# EAGLE schematic untitled (EAGLE 8.0.1)
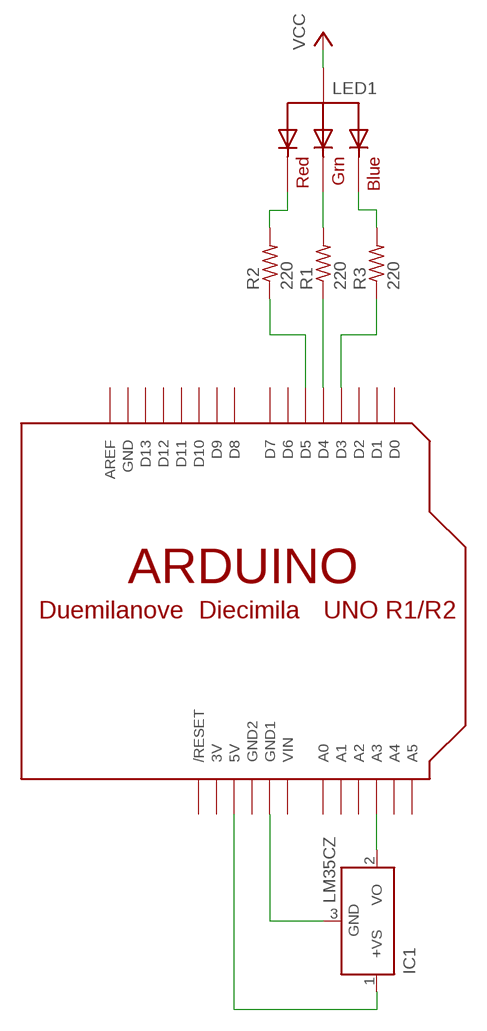
[diagram p0: schematic, sheet 1]

## Parts
IC1  LM35CZ  [TO92]
LED1  RGBLED_CA-5MM  [LED5MMRGB]
R1  220  R-US_0204/5  [0204/5]
R2  220  R-US_0204/5  [0204/5]
R3  220  R-US_0204/5  [0204/5]
U$1  ARDUINOUNO  [ARDUINO]

## Nets
N$1: IC1.3(GND) U$1.GND1
N$2: IC1.1(+VS) U$1.5V
N$3: IC1.2(VO) U$1.A3
N$4: LED1.1(RED) R2.2
N$5: LED1.3(GREEN) R1.2
N$6: LED1.4(BLUE) R3.2
N$7: R1.1 U$1.D4
N$8: R3.1 U$1.D3
N$9: R2.1 U$1.D5
VCC: LED1.2(VCC)
Unconnected: U$1.A0 U$1.A1 U$1.A2 U$1.A4 U$1.A5 U$1.AREF U$1.D0 U$1.D1 U$1.D2 U$1.D6 U$1.D7 U$1.D8 U$1.D9 U$1.D10 U$1.D11 U$1.D12 U$1.D13 U$1.RESET(/RESET)

## Power pins joined to a net without a drawn wire
3V: U$1.3V
GND: U$1.GND
GND2: U$1.GND2
VIN: U$1.VIN

## Library data of the parts
IC1 = lm35:LM35: Single-Supply Centigrade Temperature Sensor Vout = (10mV/°C x Temp °C) +5mmmV Source: http://www.national.com/ds/LM/LM35.pdf
LED1 = adafruit:RGBLED_CA: RGB LED, common-anode 5MM Staggered pins 5mm Piranha package http://www.ladyada.net/library/pcb/eaglelibrary.html
R1-R3 = adafruit:R-US_: RESISTOR, American symbol
U$1 = adafruit:ARDUINO: Arduino Diecimila/Duemilanove Make a shield with ease, this package has all the named pins as well as the two mounting drill holes and an outline of the USB and DC power connector. The outline is on the DIMENSION layer, so if your board house uses it they will cut the outline to match. http://www.ladyada.net/library/pcb/eaglelibrary.html